# Altium schematic sheet EFM32_G11_MCU.SchDoc: EFM32_G11 MCU
size A3; Revision: 1
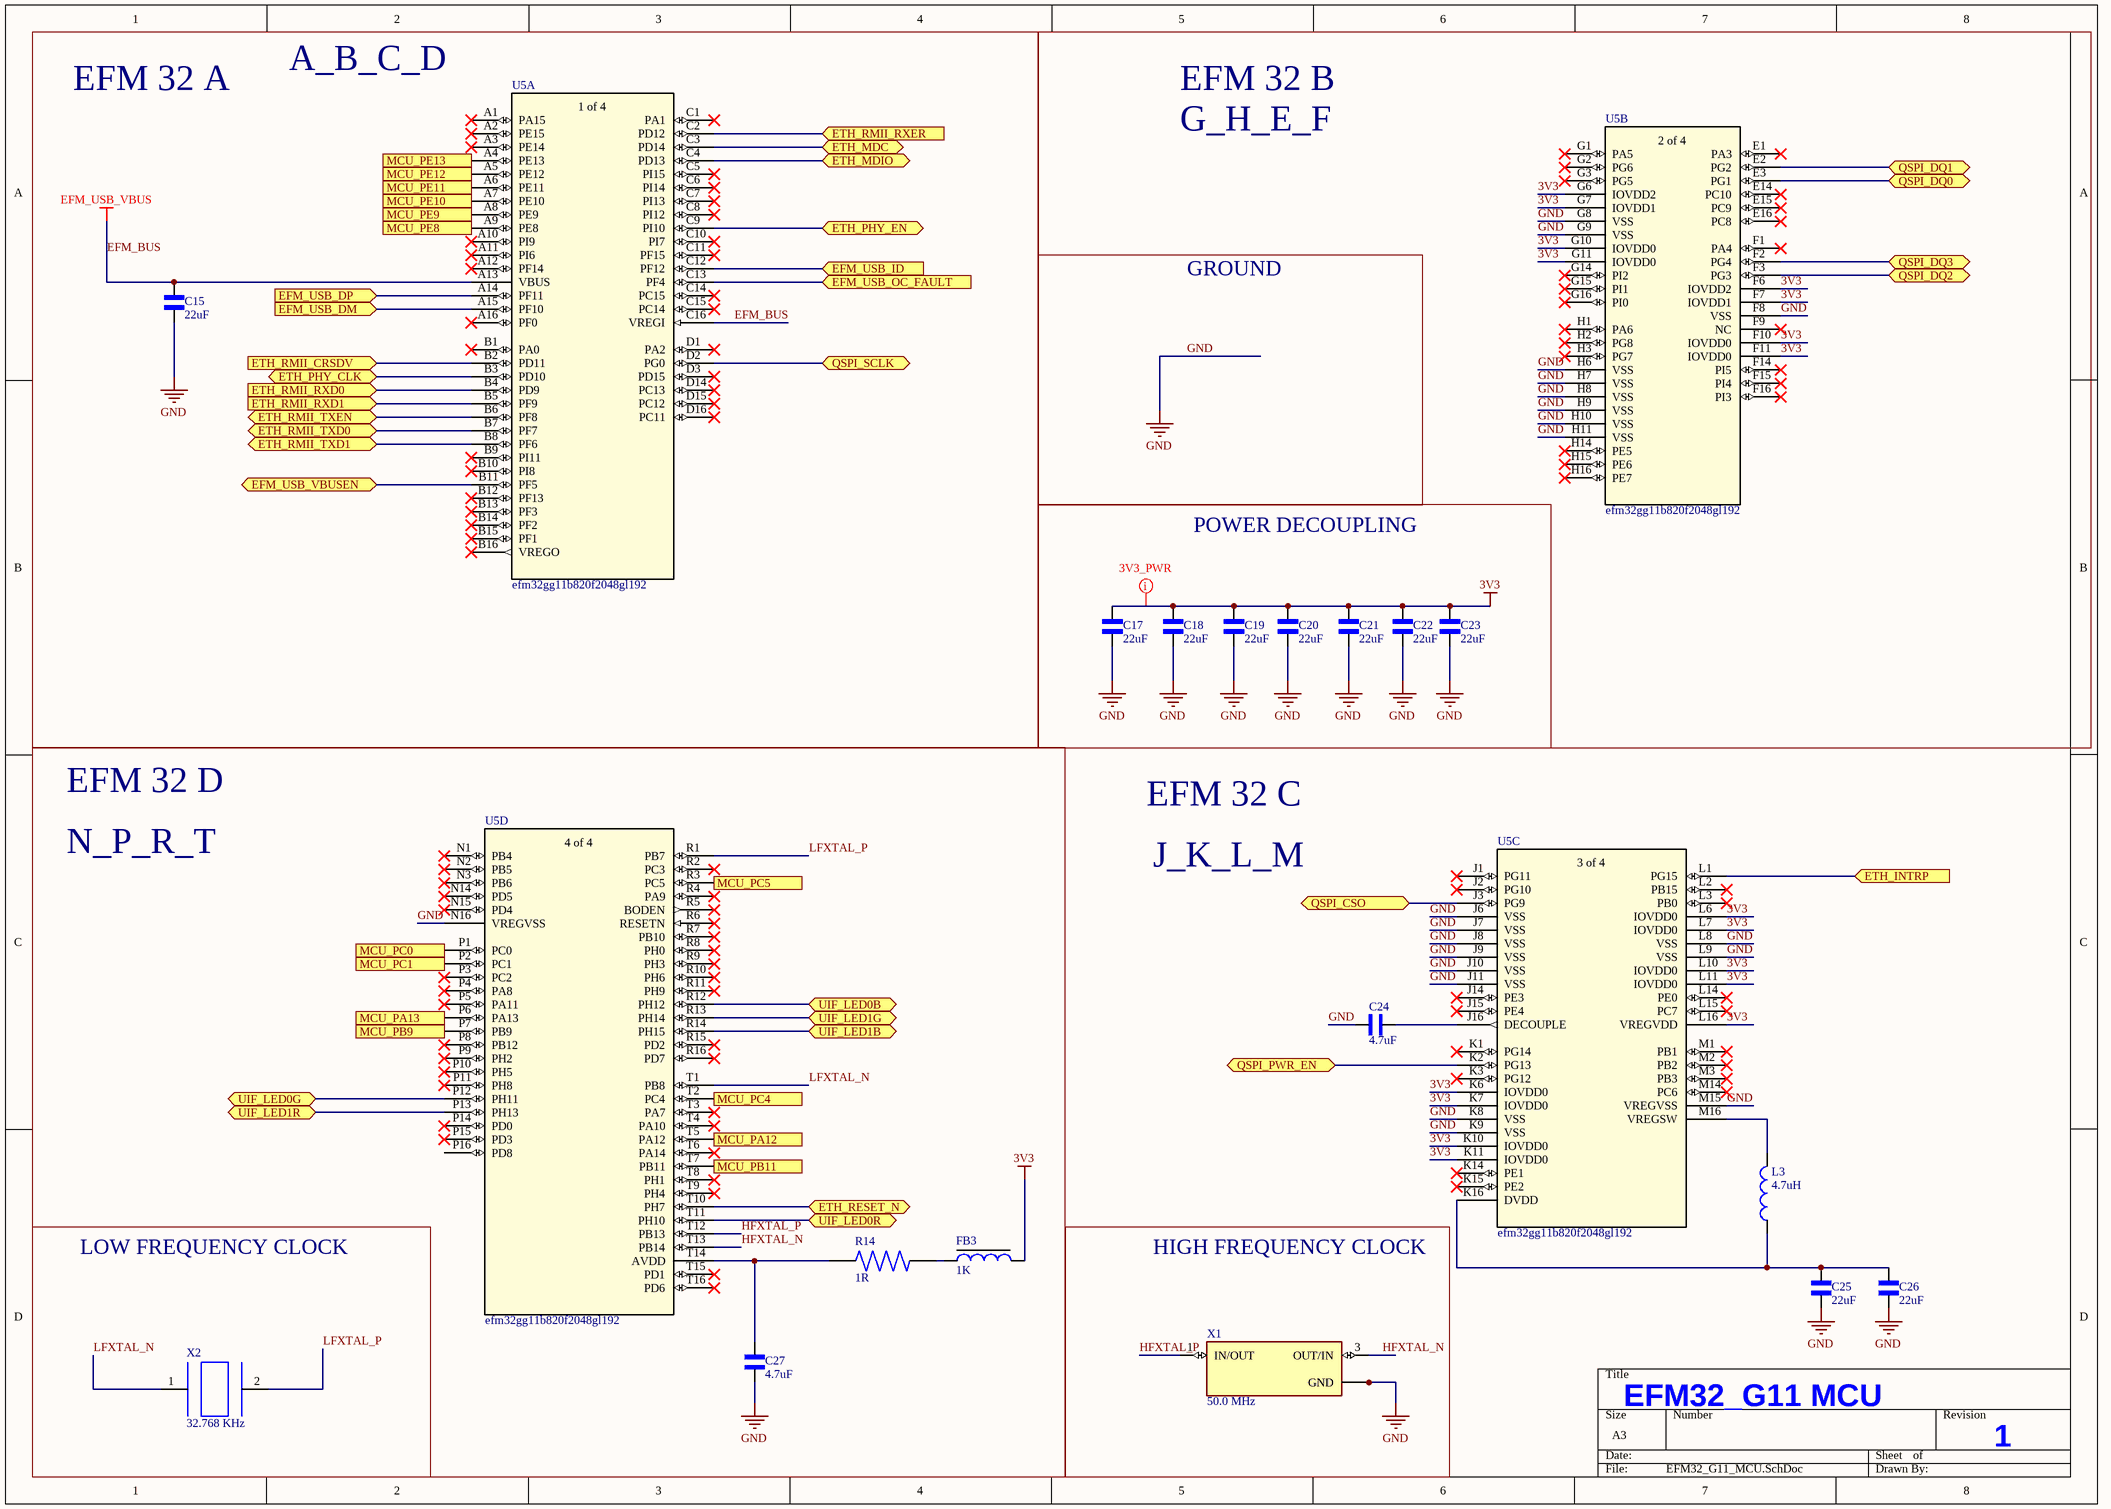
[diagram p0: EFM32_G11_MCU.SchDoc]

## Parts
C15  22uF  [C0603]
C17  22uF  [C0603]
C18  22uF  [C0603]
C19  22uF  [C0603]
C20  22uF  [C0603]
C21  22uF  [C0603]
C22  22uF  [C0603]
C23  22uF  [C0603]
C24  4.7uF  [C0603]
C25  22uF  [C0603]
C26  22uF  [C0603]
C27  4.7uF  [C0603]
FB3  1K  [FB0402]
L3  4.7uH  [L0805]
R14  1R  [R0402 Vishay]
U5  efm32gg11b820f2048gl192  [MCU_GG11]  (parts A,B,C,D of 4)
X1  50.0 MHz  [XTAL_ECS-500-8-47B-CWY-TR]
X2  32.768 KHz  [XTAL_FC-135_32.7680KA-A0]

## Blocks framed on the sheet
POWER DECOUPLING: C17-C23
LOW FREQUENCY CLOCK: X2
HIGH FREQUENCY CLOCK: X1

## Ports
EFM_USB_DM (in), EFM_USB_DP (in), EFM_USB_ID (in), EFM_USB_OC_FAULT (in), EFM_USB_VBUSEN (bidir), ETH_INTRP (in), ETH_MDC (bidir), ETH_MDIO (bidir), ETH_PHY_CLK (bidir), ETH_PHY_EN (bidir), ETH_RESET_N (bidir), ETH_RMII_CRSDV (in), ETH_RMII_RXD0 (in), ETH_RMII_RXD1 (in), ETH_RMII_RXER (in), ETH_RMII_TXD0 (bidir), ETH_RMII_TXD1 (bidir), ETH_RMII_TXEN (bidir), MCU_PA12 (out), MCU_PA13 (out), MCU_PB9 (out), MCU_PB11 (out), MCU_PC0 (out), MCU_PC1 (out), MCU_PC4 (out), MCU_PC5 (out), MCU_PE8 (out), MCU_PE9 (out), MCU_PE10 (out), MCU_PE11 (out), MCU_PE12 (out), MCU_PE13 (out), QSPI_CSO (bidir), QSPI_DQ0 (bidir), QSPI_DQ1 (bidir), QSPI_DQ2 (bidir), QSPI_DQ3 (bidir), QSPI_PWR_EN (bidir), QSPI_SCLK (bidir), UIF_LED0B (bidir), UIF_LED0G (bidir), UIF_LED0R (bidir), UIF_LED1B (bidir), UIF_LED1G (bidir), UIF_LED1R (bidir)

## Nets
3V3: C17.2 C18.2 C19.1 C20.1 C21.1 C22.1 C23.1 FB3.2 U5.F6(IOVDD2) U5.F7(IOVDD1) U5.F10(IOVDD0) U5.F11(IOVDD0) U5.G6(IOVDD2) U5.G7(IOVDD1) U5.G10(IOVDD0) U5.G11(IOVDD0) U5.K6(IOVDD0) U5.K7(IOVDD0) U5.K10(IOVDD0) U5.K11(IOVDD0) U5.L6(IOVDD0) U5.L7(IOVDD0) U5.L10(IOVDD0) U5.L11(IOVDD0) U5.L16(VREGVDD)
EFM_BUS: C15.2 U5.A13(VBUS) U5.C16(VREGI)  [also labelled EFM_USB_VBUS]
GND: C15.1 C17.1 C18.1 C19.2 C20.2 C21.2 C22.2 C23.2 C24.1 C25.2 C26.2 C27.1 U5.F8(VSS) U5.G8(VSS) U5.G9(VSS) U5.H6(VSS) U5.H7(VSS) U5.H8(VSS) U5.H9(VSS) U5.H10(VSS) U5.H11(VSS) U5.J6(VSS) U5.J7(VSS) U5.J8(VSS) U5.J9(VSS) U5.J10(VSS) U5.J11(VSS) U5.K8(VSS) U5.K9(VSS) U5.L8(VSS) U5.L9(VSS) U5.M15(VREGVSS) U5.N16(VREGVSS) X1.2(GND) X1.4(GND)
EFM_USB_DM: U5.A15(PF10) ; port EFM_USB_DM
EFM_USB_DP: U5.A14(PF11) ; port EFM_USB_DP
EFM_USB_ID: U5.C12(PF12) ; port EFM_USB_ID
EFM_USB_OC_FAULT: U5.C13(PF4) ; port EFM_USB_OC_FAULT
EFM_USB_VBUSEN: U5.B11(PF5) ; port EFM_USB_VBUSEN
ETH_INTRP: U5.L1(PG15) ; port ETH_INTRP
ETH_MDC: U5.C3(PD14) ; port ETH_MDC
ETH_MDIO: U5.C4(PD13) ; port ETH_MDIO
ETH_PHY_CLK: U5.B3(PD10) ; port ETH_PHY_CLK
ETH_PHY_EN: U5.C9(PI10) ; port ETH_PHY_EN
ETH_RESET_N: U5.T10(PH7) ; port ETH_RESET_N
ETH_RMII_CRSDV: U5.B2(PD11) ; port ETH_RMII_CRSDV
ETH_RMII_RXD0: U5.B4(PD9) ; port ETH_RMII_RXD0
ETH_RMII_RXD1: U5.B5(PF9) ; port ETH_RMII_RXD1
ETH_RMII_RXER: U5.C2(PD12) ; port ETH_RMII_RXER
ETH_RMII_TXD0: U5.B7(PF7) ; port ETH_RMII_TXD0
ETH_RMII_TXD1: U5.B8(PF6) ; port ETH_RMII_TXD1
ETH_RMII_TXEN: U5.B6(PF8) ; port ETH_RMII_TXEN
HFXTAL_N: U5.T13(PB14) X1.3(OUT/IN)
HFXTAL_P: U5.T12(PB13) X1.1(IN/OUT)
LFXTAL_N: U5.T1(PB8) X2.1
LFXTAL_P: U5.R1(PB7) X2.2
MCU_PA12: U5.T5(PA12) ; port MCU_PA12
MCU_PA13: U5.P6(PA13) ; port MCU_PA13
MCU_PB9: U5.P7(PB9) ; port MCU_PB9
MCU_PB11: U5.T7(PB11) ; port MCU_PB11
MCU_PC0: U5.P1(PC0) ; port MCU_PC0
MCU_PC1: U5.P2(PC1) ; port MCU_PC1
MCU_PC4: U5.T2(PC4) ; port MCU_PC4
MCU_PC5: U5.R3(PC5) ; port MCU_PC5
MCU_PE8: U5.A9(PE8) ; port MCU_PE8
MCU_PE9: U5.A8(PE9) ; port MCU_PE9
MCU_PE10: U5.A7(PE10) ; port MCU_PE10
MCU_PE11: U5.A6(PE11) ; port MCU_PE11
MCU_PE12: U5.A5(PE12) ; port MCU_PE12
MCU_PE13: U5.A4(PE13) ; port MCU_PE13
QSPI_CSO: U5.J3(PG9) ; port QSPI_CSO
QSPI_DQ0: U5.E3(PG1) ; port QSPI_DQ0
QSPI_DQ1: U5.E2(PG2) ; port QSPI_DQ1
QSPI_DQ2: U5.F3(PG3) ; port QSPI_DQ2
QSPI_DQ3: U5.F2(PG4) ; port QSPI_DQ3
QSPI_PWR_EN: U5.K2(PG13) ; port QSPI_PWR_EN
QSPI_SCLK: U5.D2(PG0) ; port QSPI_SCLK
UIF_LED0B: U5.R12(PH12) ; port UIF_LED0B
UIF_LED0G: U5.P12(PH11) ; port UIF_LED0G
UIF_LED0R: U5.T11(PH10) ; port UIF_LED0R
UIF_LED1B: U5.R14(PH15) ; port UIF_LED1B
UIF_LED1G: U5.R13(PH14) ; port UIF_LED1G
UIF_LED1R: U5.P13(PH13) ; port UIF_LED1R
NetC24_2: C24.2 U5.J16(DECOUPLE)
NetC25_1: C25.1 C26.1 L3.1 U5.K16(DVDD)
NetC27_2: C27.2 R14.1 U5.T14(AVDD)
NetFB3_1: FB3.1 R14.2
NetL3_2: L3.2 U5.M16(VREGSW)

Not connected (* = marked no-connect by the designer): U5 A1(PA15)* A2(PE15)* A3(PE14)* A10(PI9)* A11(PI6)* A12(PF14)* A16(PF0)* B1(PA0)* B9(PI11)* B10(PI8)* B12(PF13)* B13(PF3)* B14(PF2)* B15(PF1)* B16(VREGO)* C1(PA1)* C5(PI15)* C6(PI14)* C7(PI13)* C8(PI12)* C10(PI7)* C11(PF15)* C14(PC15)* C15(PC14)* D1(PA2)* D3(PD15)* D14(PC13)* D15(PC12)* D16(PC11)* E1(PA3)* E14(PC10)* E15(PC9)* E16(PC8)* F1(PA4)* F9(NC)* F14(PI5)* F15(PI4)* F16(PI3)* G1(PA5)* G2(PG6)* G3(PG5)* G14(PI2)* G15(PI1)* G16(PI0)* H1(PA6)* H2(PG8)* H3(PG7)* H14(PE5)* H15(PE6)* H16(PE7)* J1(PG11)* J2(PG10)* J14(PE3)* J15(PE4)* K1(PG14)* K3(PG12)* K14(PE1)* K15(PE2)* L2(PB15)* L3(PB0)* L14(PE0)* L15(PC7)* M1(PB1)* M2(PB2)* M3(PB3)* M14(PC6)* N1(PB4)* N2(PB5)* N3(PB6)* N14(PD5)* N15(PD4)* P3(PC2)* P4(PA8)* P5(PA11)* P8(PB12)* P9(PH2)* P10(PH5)* P11(PH8)* P14(PD0)* P15(PD3)* P16(PD8) R2(PC3)* R4(PA9)* R5(BODEN)* R6(RESETN)* R7(PB10)* R8(PH0)* R9(PH3)* R10(PH6)* R11(PH9)* R15(PD2)* R16(PD7)* T3(PA7)* T4(PA10)* T6(PA14)* T8(PH1)* T9(PH4)* T15(PD1)* T16(PD6)*

## Layout directives
rule Width Constraint [Pref Width = 20mil    Min Width = 6mil    Max Width = 100mil]: 3V3

## Notes on the sheet
- EFM 32 A
- A_B_C_D
- EFM 32 B
- G_H_E_F
- GROUND
- EFM 32 D
- N_P_R_T
- EFM 32 C
- J_K_L_M
- (in symbol EFM32GG11B820F20, part A) 1 of 4
- (in symbol EFM32GG11B820F20, part B) 2 of 4
- (in symbol EFM32GG11B820F20, part C) 3 of 4
- (in symbol EFM32GG11B820F20, part D) 4 of 4

## Library data of the parts
C15 C17-C23 C25 C26 = ZRB18AR61A226ME01L: 0603 22 uF 10 V ±20% Tolerance X5R Surface Mount Multilayer Ceramic Capacitor; Manufacturer: Murata; Voltage Rating: 10V; Supplier 1: Mouser; Manufacturer Part Number: ZRB18AR61A226ME01L; RoHS: No; Category: Ceramic Capacitors; Stock 1: 179696; Pricing 1: 1=0.44000, 10=0.30400, 100=0.18300, 500=0.13700, 1000=0.11600, 3000=0.09500 (USD); Mount: Surface Mount; Case/Package: 0603; Min Operating Temperature: -55°C; Max Operating Temperature: 85°C; Packaging: Tape and Reel; Capacitance: 22uF; Tolerance: 20%; ComponentLink1URL: http://search.murata.co.jp/Ceramy/image/img/A01X/G101/ENG/ZRB18AR61A226ME01-02.pdf?src-supplier=Digi-Key; ComponentLink1Description: http://search.murata.co.jp/Ceramy/image/img/A01X/G101/ENG/ZRB18AR61A226ME01-02.pdf?src-supplier=Digi-Key; Supplier Part Number 1: 81-ZRB18AR61A226ME1L
C24 C27 = CL10A475KP8NNNC: Cap Ceramic 4.7uF 10V X5R 10% Pad SMD 0603 85C T/R; Manufacturer: Samsung; Supplier 1: Digi-Key; Manufacturer Part Number: CL10A475KP8NNNC; RoHS: Yes; Category: Ceramic Capacitors; Stock 1: 274416; Pricing 1: 1=0.10000, 10=0.04800, 50=0.02620, 100=0.02140, 500=0.01528, 1000=0.01201 (USD); Mount: Surface Mount; Case/Package: 0603; Case Code (Imperial): 0603; Contact Plating: Tin; Case Code (Metric): 1608; Min Operating Temperature: -55°C; Max Operating Temperature: 85°C; Tolerance: 10%; Capacitance: 4.7uF; Dielectric: X5R; Package Quantity: 1; Packaging: Tape and Reel; Voltage Rating: 10V; Length: 1.6mm; Width: 0.031inch; Height: 0.8mm; Thickness: 0.035inch; Depth: 0.8mm; Radiation Hardening: No; ComponentLink1URL: https://datasheet.ciiva.com/25797/cl10a475kp8nnnc-25797520.pdf?src-supplier=Digi-Key; ComponentLink1Description: https://datasheet.ciiva.com/25797/cl10a475kp8nnnc-25797520.pdf?src-supplier=Digi-Key; ComponentLink2URL: https://datasheet.ciiva.com/26838/getdatasheetpartid-358676-26838384.pdf?src-supplier=Verical; ComponentLink2Description: https://datasheet.ciiva.com/26838/getdatasheetpartid-358676-26838384.pdf?src-supplier=Verical; ComponentLink3URL: https://datasheet.ciiva.com/16318/cl05b104kq5nnnc-16318245.pdf?src-supplier=Future+Electronics; ComponentLink3Description: https://datasheet.ciiva.com/16318/cl05b104kq5nnnc-16318245.pdf?src-supplier=Future+Electronics; Supplier Part Number 1: 1276-1044-1-ND
FB3 = BLM15AG102SH1D: FERRITE BEAD 1 KOHM 0402 1LN; Manufacturer: Murata; Impedance: 1kR; Tolerance: 25%; Max DC Current: 200mA; DC Resistance (DCR): 1R; Test Frequency: 100MHz; Number of Lines: 1; Supplier 1: Digi-Key; Manufacturer Part Number: BLM15AG102SH1D; RoHS: Yes; Category: Ferrite Beads and Chips; Stock 1: 79326; Pricing 1: 1=0.11000, 10=0.09300, 25=0.08320, 50=0.06100, 100=0.05270, 250=0.04164, 500=0.03516, 1000=0.02960, 5000=0.02636 (USD); Mount: Surface Mount; Case/Package: 0402; Core Material: Ferrite; Case Code (Metric): 1005; Case Code (Imperial): 0402; Min Operating Temperature: -55°C; Max Operating Temperature: 125°C; Packaging: Tape and Reel; Package Quantity: 10000; Termination: SMD/SMT; Max Current Rating: 200mA; Number of Circuits: 1; Length: 0.039inch; Width: 0.5mm; Height: 0.022inch; Depth: 0.55mm; Ratings: AEC-Q200; REACH SVHC: No SVHC; ComponentLink1URL: https://datasheet.ciiva.com/29364/l0132s0193blm15a-sh-29364285.pdf?src-supplier=Digi-Key; ComponentLink1Description: https://datasheet.ciiva.com/29364/l0132s0193blm15a-sh-29364285.pdf?src-supplier=Digi-Key; ComponentLink2URL: https://datasheet.ciiva.com/17279/l0132s0193blm15a-sh-17279626.pdf?src-supplier=Avnet+Europe; ComponentLink2Description: https://datasheet.ciiva.com/17279/l0132s0193blm15a-sh-17279626.pdf?src-supplier=Avnet+Europe; ComponentLink3URL: https://datasheet.ciiva.com/8510/l0132s0193blm15a-sh-8510171.pdf?src-supplier=Avnet; ComponentLink3Description: https://datasheet.ciiva.com/8510/l0132s0193blm15a-sh-8510171.pdf?src-supplier=Avnet; ComponentLink4URL: https://datasheet.ciiva.com/29364/l0132s0193blm15a-sh-29364283.pdf?src-supplier=Digi-Key; ComponentLink4Description: https://datasheet.ciiva.com/29364/l0132s0193blm15a-sh-29364283.pdf?src-supplier=Digi-Key; ComponentLink5URL: https://datasheet.ciiva.com/29364/l0132s0193blm15a-sh-29364286.pdf?src-supplier=Digi-Key; ComponentLink5Description: https://datasheet.ciiva.com/29364/l0132s0193blm15a-sh-29364286.pdf?src-supplier=Digi-Key; Supplier Part Number 1: 490-7804-1-ND
L3 = LQM21PN4R7MGRB: Inductor with Inductance: 4.7uH Tol. +/-20%, Package: 0805 (2012); MF: Murata; Availability: Bad; SnapEDA_Link: https://www.snapeda.com/parts/LQM21PN4R7MGRB/Murata/view-part/4470527/?ref=snap; MP: LQM21PN4R7MGRB; Value: *; Price: None; Package: 2012 Murata; Check_prices: https://www.snapeda.com/parts/LQM21PN4R7MGRB/Murata/view-part/4470527/?ref=eda
R14 = CRCW04021R00FNED: RES SMD 1 OHM 1% 1/16W 0402; Manufacturer: Vishay; Power Rating: 63mW; Voltage Rating: 50V; Temperature Coefficient: 200ppm/°C; Supplier 1: Digi-Key; Manufacturer Part Number: CRCW04021R00FNED; RoHS: Yes; Category: Chip SMD Resistors; Stock 1: 16685; Pricing 1: 1=0.10000, 10=0.05000, 100=0.02040, 1000=0.00914, 2500=0.00794, 5000=0.00656 (USD); Mount: Surface Mount; Case/Package: 0402; Number of Pins: 2; Weight: 2.3E-05oz; Case Code (Metric): 1005; Case Code (Imperial): 0402; Contact Plating: Tin; Min Operating Temperature: -55°C; Max Operating Temperature: 155°C; Resistance: 1R; Tolerance: 1%; Packaging: Tape and Reel; Package Quantity: 10000; Resistor Type: Thick Film; Number of Terminations: 2; Termination: SMD/SMT; Max Power Dissipation: 63mW; Voltage Rating (DC): 50V; Features: Automotive AEC-Q200; Length: 1mm; Width: 0.02inch; Height: 0.016inch; Depth: 0.5mm; Radiation Hardening: No; REACH SVHC: Unknown; Military Standard: Not; Lead Free: Lead Free; ComponentLink1URL: https://datasheet.ciiva.com/2560/dcrcwe3-2560101.pdf?src-supplier=Digi-Key; ComponentLink1Description: https://datasheet.ciiva.com/2560/dcrcwe3-2560101.pdf?src-supplier=Digi-Key; ComponentLink2URL: https://datasheet.ciiva.com/6027/1697337-6027861.pdf?src-supplier=Farnell; ComponentLink2Description: https://datasheet.ciiva.com/6027/1697337-6027861.pdf?src-supplier=Farnell; ComponentLink3URL: https://datasheet.ciiva.com/2560/dcrcwe3-2560102.pdf?src-supplier=Digi-Key; ComponentLink3Description: https://datasheet.ciiva.com/2560/dcrcwe3-2560102.pdf?src-supplier=Digi-Key; ComponentLink4URL: https://datasheet.ciiva.com/2560/dcrcwe3-2560103.pdf?src-supplier=Digi-Key; ComponentLink4Description: https://datasheet.ciiva.com/2560/dcrcwe3-2560103.pdf?src-supplier=Digi-Key; ComponentLink5URL: https://datasheet.ciiva.com/3256/dcrcwe3-3256199.pdf?src-supplier=Avnet; ComponentLink5Description: https://datasheet.ciiva.com/3256/dcrcwe3-3256199.pdf?src-supplier=Avnet; ComponentLink6URL: https://datasheet.ciiva.com/3256/dcrcwe3-3256200.pdf?src-supplier=Avnet; ComponentLink6Description: https://datasheet.ciiva.com/3256/dcrcwe3-3256200.pdf?src-supplier=Avnet; ComponentLink7URL: https://datasheet.ciiva.com/5552/dcrcwe3-109170-5552232.pdf?src-supplier=Mouser; ComponentLink7Description: https://datasheet.ciiva.com/5552/dcrcwe3-109170-5552232.pdf?src-supplier=Mouser; ComponentLink8URL: https://datasheet.ciiva.com/16436/dcrcwe3-16436173.pdf?src-supplier=Future+Electronics; ComponentLink8Description: https://datasheet.ciiva.com/16436/dcrcwe3-16436173.pdf?src-supplier=Future+Electronics; ComponentLink9URL: https://datasheet.ciiva.com/7841/125364-7841807.pdf?src-supplier=Element14; ComponentLink9Description: https://datasheet.ciiva.com/7841/125364-7841807.pdf?src-supplier=Element14; Supplier Part Number 1: 541-1.00LCT-ND
U5 = EFM32GG11B820F20: No Description Available; Vendor: Silicon Labs; Copyright: Copyright (C) 2016 Accelerated Designs. All rights reserved; Manufacturer_Part_Number: efm32gg11b820f2048gl192; RefDes: RefDes; Type: DEV; Value: Value
X1 = ECS-500-8-47B-CWY-TR: CRYSTAL 50.0000MHZ 8PF SMD; MF: ECS Inc.; Price: None; Check_prices: https://www.snapeda.com/parts/ECS-500-8-47B-CWY-TR/ECS%20Inc./view-part/5049033/?ref=eda; SnapEDA_Link: https://www.snapeda.com/parts/ECS-500-8-47B-CWY-TR/ECS%20Inc./view-part/5049033/?ref=snap; Package: None; Purchase-URL: https://pricing.snapeda.com/search/part/ECS-500-8-47B-CWY-TR/?ref=eda; Availability: Warning; MP: ECS-500-8-47B-CWY-TR; Value: *
X2 = FC-135_32.7680KA-A0: 32.768kHz Â±20ppm Crystal 12.5pF 70 kOhms 2-SMD, No Lead; MP: FC-135 32.7680KA-A0; MF: EPSON; Package: SMD-2 Epson; SnapEDA_Link: https://www.snapeda.com/parts/FC-135%2032.7680KA-A0/EPSON/view-part/51409/?ref=snap; Availability: Unavailable; Value: *; Price: None